# Altium schematic sheet MPP_M2_extension.SchDoc: FPGA Peripherals Board - M.2 Key E
size A3; Author: mayerph; DrawnBy: mayerph; Organization: IIS; Revision: PA; SheetNumber: 3; SheetTotal: 7
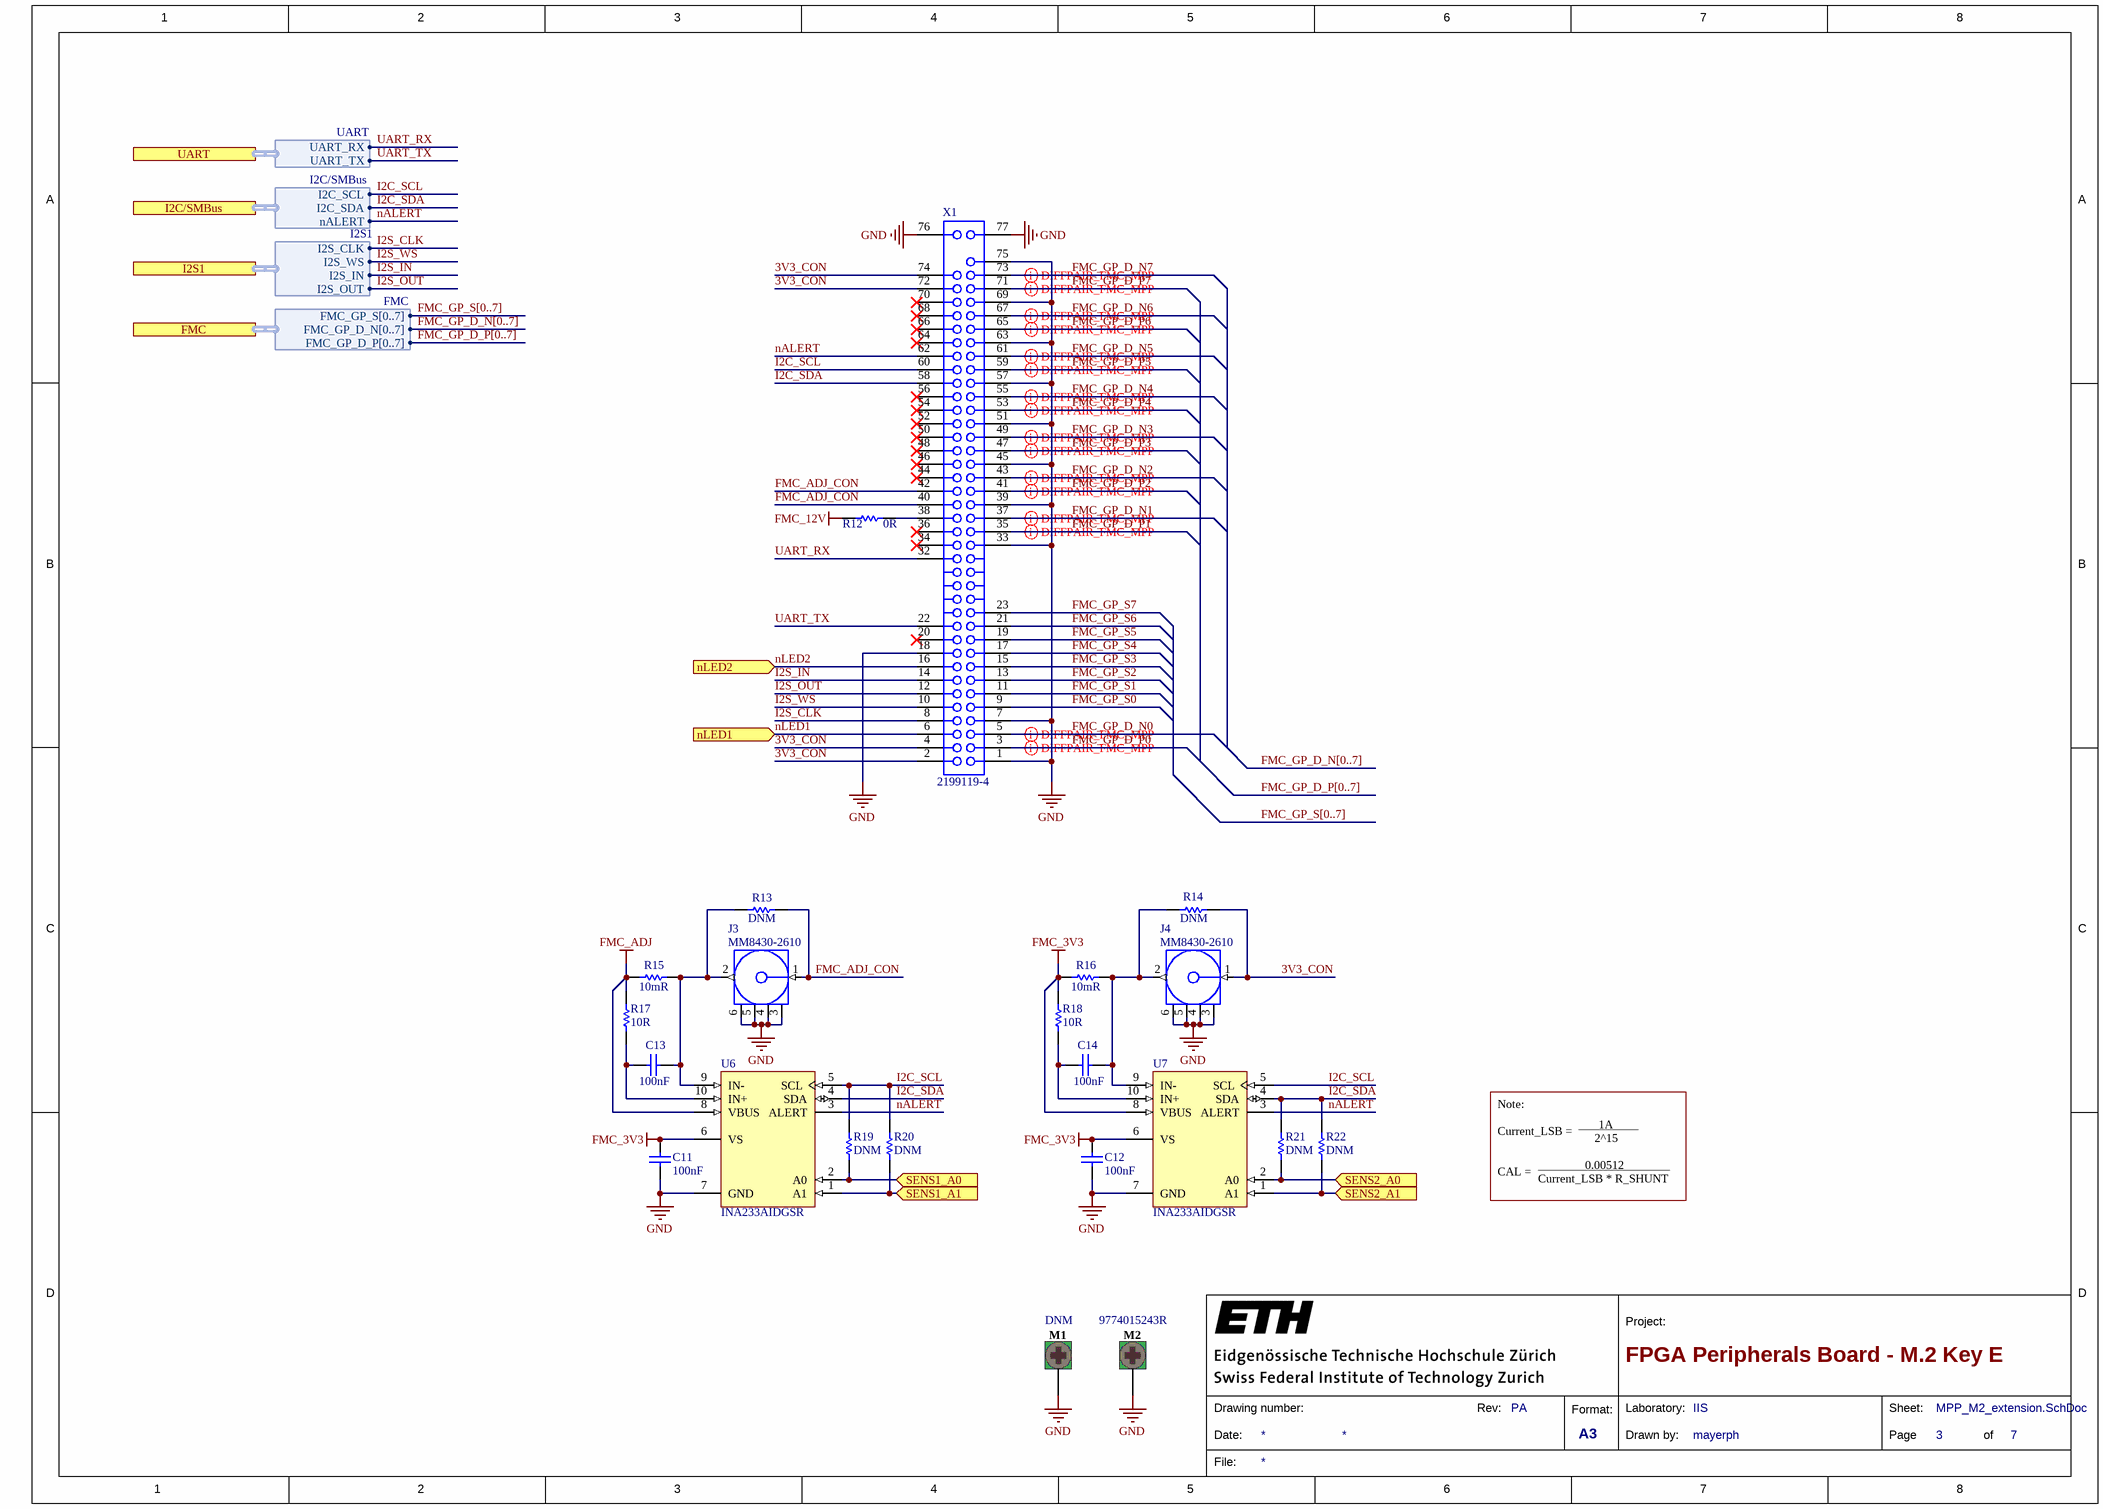
[diagram p0: MPP_M2_extension.SchDoc]

## Parts
C11  100nF  [CAPC1050X55X23LL05T13]
C12  100nF  [CAPC1050X55X23LL05T13]
C13  100nF  [CAPC1050X55X23LL05T13]
C14  100nF  [CAPC1050X55X23LL05T13]
J3  MM8430-2610  [MM8430-2610]
J4  MM8430-2610  [MM8430-2610]
M1  DNM  [9774015243R]
M2  9774015243R  [9774015243R]
R12  0R  [RESC1005X40X25LL05T10]
R13  DNM  [RESC1005X40X25LL05T10]
R14  DNM  [RESC1005X40X25LL05T10]
R15  10mR  [RESC3116X65X40NL10T20]
R16  10mR  [RESC3116X65X40NL10T20]
R17  10R  [RESC1005X40X25LL10T10]
R18  10R  [RESC1005X40X25LL10T10]
R19  DNM  [RESC1005X40X25LL05T10]
R20  DNM  [RESC1005X40X25LL05T10]
R21  DNM  [RESC1005X40X25LL05T10]
R22  DNM  [RESC1005X40X25LL05T10]
U6  INA233AIDGSR  [ADI-RM-10_N]
U7  INA233AIDGSR  [ADI-RM-10_N]
X1  2199119-4  [2199119-4]

## Ports
FMC (harness FMC), I2C/SMBus (harness I2C/SMBus), I2S1 (harness I2S1), nLED1 (in), nLED2 (in), SENS1_A0 (in), SENS1_A1 (in), SENS2_A0 (in), SENS2_A1 (in), UART (harness UART)

## Harnesses
I2C/SMBus: I2C_SDA, I2C_SCL, nALERT
UART: UART_TX, UART_RX
I2S1: I2S_OUT, I2S_IN, I2S_WS, I2S_CLK
FMC: FMC_GP_D_N[0..7], FMC_GP_S[0..7], FMC_GP_D_P[0..7]

## Nets
FMC_3V3: C11.2 C12.2 R16.1 R18.2 U6.6(VS) U7.6(VS) U7.8(VBUS)
FMC_12V: R12.2
FMC_ADJ: R15.1 R17.2 U6.8(VBUS)
GND: C11.1 C12.1 J3.3(GND) J3.4(GND) J3.5(GND) J3.6(GND) J4.3(GND) J4.4(GND) J4.5(GND) J4.6(GND) M1.1 M2.1 U6.7(GND) U7.7(GND) X1.1 X1.7 X1.18 X1.33 X1.39 X1.45 X1.51 X1.57 X1.63 X1.69 X1.75 X1.76 X1.77
3V3_CON: J4.1(Signal) R14.1 X1.2 X1.4 X1.72 X1.74
FMC_ADJ_CON: J3.1(Signal) R13.1 X1.40 X1.42
FMC_GP_D_N0: X1.5
FMC_GP_D_N1: X1.37
FMC_GP_D_N2: X1.43
FMC_GP_D_N3: X1.49
FMC_GP_D_N4: X1.55
FMC_GP_D_N5: X1.61
FMC_GP_D_N6: X1.67
FMC_GP_D_N7: X1.73
FMC_GP_D_P0: X1.3
FMC_GP_D_P1: X1.35
FMC_GP_D_P2: X1.41
FMC_GP_D_P3: X1.47
FMC_GP_D_P4: X1.53
FMC_GP_D_P5: X1.59
FMC_GP_D_P6: X1.65
FMC_GP_D_P7: X1.71
FMC_GP_S0: X1.9
FMC_GP_S1: X1.11
FMC_GP_S2: X1.13
FMC_GP_S3: X1.15
FMC_GP_S4: X1.17
FMC_GP_S5: X1.19
FMC_GP_S6: X1.21
FMC_GP_S7: X1.23
I2C_SCL: R19.1 R20.1 U6.5(SCL) U7.5(SCL) X1.60 ; port I2C/SMBus.I2C_SCL
I2C_SDA: R21.1 R22.1 U6.4(SDA) U7.4(SDA) X1.58 ; port I2C/SMBus.I2C_SDA
I2S_CLK: X1.8 ; port I2S1.I2S_CLK
I2S_IN: X1.14 ; port I2S1.I2S_IN
I2S_OUT: X1.12 ; port I2S1.I2S_OUT
I2S_WS: X1.10 ; port I2S1.I2S_WS
nALERT: U6.3(ALERT) U7.3(ALERT) X1.62 ; port I2C/SMBus.nALERT
nLED1: X1.6 ; port nLED1
nLED2: X1.16 ; port nLED2
SENS1_A0: R19.2 U6.2(A0) ; port SENS1_A0
SENS1_A1: R20.2 U6.1(A1) ; port SENS1_A1
SENS2_A0: R21.2 U7.2(A0) ; port SENS2_A0
SENS2_A1: R22.2 U7.1(A1) ; port SENS2_A1
UART_RX: X1.32 ; port UART.UART_RX
UART_TX: X1.22 ; port UART.UART_TX
NetC13_1: C13.1 J3.2(Signal) R13.2 R15.2 U6.9(IN-)
NetC13_2: C13.2 R17.1 U6.10(IN+)
NetC14_1: C14.1 J4.2(Signal) R14.2 R16.2 U7.9(IN-)
NetC14_2: C14.2 R18.1 U7.10(IN+)
NetR12_1: R12.1 X1.38

Not connected (* = marked no-connect by the designer): X1 20* 34* 36* 44* 46* 48* 50* 52(51)* 54(52)* 56(53)* 64* 66* 68* 70*

## Buses and harness runs
bus FMC_GP_D_N[0..7]
bus FMC_GP_D_P[0..7]
bus FMC_GP_S[0..7]

## Layout directives
differential pair; net class DP_FMC_MPP_CON1: FMC_GP_D_N0, FMC_GP_D_N1, FMC_GP_D_N2, FMC_GP_D_N3, FMC_GP_D_N4, FMC_GP_D_N5, FMC_GP_D_N6, FMC_GP_D_N7, FMC_GP_D_P0, FMC_GP_D_P1, FMC_GP_D_P2, FMC_GP_D_P3, FMC_GP_D_P4, FMC_GP_D_P5, FMC_GP_D_P6, FMC_GP_D_P7

## Notes on the sheet
- Note:
- __________
- 1A
- CAL =
- Current_LSB =
- Current_LSB * R_SHUNT
- ______________________
- 0.00512
- 2^15
- 1
- 2
- 3
- 4
- 5
- 6
- 7
- 8
- A
- B
- C
- D
- Project:
- Date:
- Drawing number:
- Rev:
- Format:
- A3
- Drawn by:
- Laboratory:
- Page
- Sheet:
- of
- File:

## Library data of the parts
C11-C14 = CMP-2000-05439-1: Chip Capacitor, 100 nF, +/- 10%, 16 V, -55 to 125 degC, 0402 (1005 Metric), RoHS, Tape and Reel; Manufacturer: Samsung Electro-Mechanics; Manufacturer Part Number: CL05B104KO5NNNC; Dielectric: X7R; Rated Voltage: 16V; Material: Ceramic; Case Size/Dimension: 0402; Tolerance (%): ±10%; Value: 100nF; Manufacturer URL: http://www.samsungsem.com/global/index.jsp; Datasheet URL: https://datasheet.ciiva.com/29198/458718-da-01-en-vs-kondensator-0402-29198423.pdf; Datasheet Version: Nov-10; Supplier 1: Digi-Key; Supplier Part Number 1: 1276-1001-1-ND; RoHS: Yes; Category: Ceramic Capacitors; Stock 1: 18886859; Pricing 1: 1=0.10000, 10=0.02800, 50=0.01520, 100=0.01240, 500=0.00886, 1000=0.00696, 2500=0.00632, 5000=0.00582 (USD); Mount: Surface Mount; Case/Package: 0402; Case Code (Metric): 1005; Case Code (Imperial): 0402; Contact Plating: Tin; Min Operating Temperature: -55°C; Max Operating Temperature: 125°C; Tolerance: 10%; Packaging: Tape and Reel; Voltage Rating: 16V; Voltage Rating (DC): 16V; Package Quantity: 1; Voltage: 16V; Length: 1mm; Height: 0.5mm; Width: 0.02inch; Depth: 0.5mm; Thickness: 0.022inch; Radiation Hardening: No; Lead Free: Lead Free; ComponentLink1URL: https://datasheet.ciiva.com/26920/getdatasheetpartid-359683-26920169.pdf?src-supplier=Verical; ComponentLink1Description: https://datasheet.ciiva.com/26920/getdatasheetpartid-359683-26920169.pdf?src-supplier=Verical; ComponentLink2URL: https://datasheet.ciiva.com/29198/458718-da-01-en-vs-kondensator-0402-29198423.pdf?src-supplier=Conrad; ComponentLink2Description: https://datasheet.ciiva.com/29198/458718-da-01-en-vs-kondensator-0402-29198423.pdf?src-supplier=Conrad; ComponentLink3URL: https://datasheet.ciiva.com/16208/cl05b104kq5nnnc-16208343.pdf?src-supplier=Future+Electronics; ComponentLink3Description: https://datasheet.ciiva.com/16208/cl05b104kq5nnnc-16208343.pdf?src-supplier=Future+Electronics; ComponentLink4URL: https://datasheet.ciiva.com/26309/mlcc-catalogdownload2013-eng-26309003.pdf?src-supplier=Distrelec; ComponentLink4Description: https://datasheet.ciiva.com/26309/mlcc-catalogdownload2013-eng-26309003.pdf?src-supplier=Distrelec
J3 J4 = CMP-01324-2: SWD Connector Receptacle, Female Socket 50Ohm Surface Mount Solder; Manufacturer: Murata; Manufacturer Part Number: MM8430-2610RA1; Impedance: 50R; Max Frequency: 6GHz; Polarity: Standard; Description: CONN SWD RCPT STR 50 OHM SMD; Fastening Type: Pull; Max Operating Temperature: 85°C; Lead Free: Lead Free; Radiation Hardening: No; Package Quantity: 1; Series: 8430; Connector Type: Socket; Mount: Surface Mount; Contact Material: Copper Alloy; Housing Color: Silver; Case/Package: SMD/SMT; Orientation: Straight; Depth: 3mm; Packaging: Tape and Reel; Insulation Material: Plastic; Length: 3mm; Contact Plating: Gold; Min Operating Temperature: -40°C; Termination: Solder; Supplier 1: Digi-Key; Supplier Part Number 1: 490-4980-1-ND; RoHS: Yes; Category: RF / Coaxial Connectors; Stock 1: 398; Pricing 1: 1=0.49000, 10=0.45800, 25=0.41200, 50=0.36620, 100=0.35100, 250=0.32048, 500=0.30520 (USD); ComponentLink1URL: https://datasheet.ciiva.com/18119/getdatasheetpartid-163587-18119363.pdf?src-supplier=Verical; ComponentLink1Description: https://datasheet.ciiva.com/18119/getdatasheetpartid-163587-18119363.pdf?src-supplier=Verical; ComponentLink2URL: https://datasheet.ciiva.com/18119/getdatasheetpartid-153066-18119191.pdf?src-supplier=Verical; ComponentLink2Description: https://datasheet.ciiva.com/18119/getdatasheetpartid-153066-18119191.pdf?src-supplier=Verical; ComponentLink3URL: https://datasheet.ciiva.com/642/o33e-642736.pdf?src-supplier=Digi-Key; ComponentLink3Description: https://datasheet.ciiva.com/642/o33e-642736.pdf?src-supplier=Digi-Key; ComponentLink4URL: https://datasheet.ciiva.com/16465/l0391e-16465770.pdf?src-supplier=Future+Electronics; ComponentLink4Description: https://datasheet.ciiva.com/16465/l0391e-16465770.pdf?src-supplier=Future+Electronics; ComponentLink5URL: https://datasheet.ciiva.com/642/o33e-642735.pdf?src-supplier=Digi-Key; ComponentLink5Description: https://datasheet.ciiva.com/642/o33e-642735.pdf?src-supplier=Digi-Key
M1 M2 = CMP-01222-1: RND STANDOFF M2X0.4 STEEL 1.5MM; Manufacturer: Wurth Electronics; Plating: Tin; Outside Diameter: 0.171inch; Threaded/Unthreaded: Threaded; Length: 0.114inch; REACH SVHC: Unknown; Material: Steel; Supplier 1: Digi-Key; Supplier Part Number 1: 732-7069-1-ND; Manufacturer Part Number: 9774015243R; RoHS: Yes; Category: Spacers, Standoffs; Stock 1: 6453; Pricing 1: 1=1.09000, 10=1.03000, 50=0.91800, 100=0.84000, 500=0.78400 (USD); ComponentLink1URL: http://www.mouser.com/ds/2/445/9774015243R-611439.pdf?src-supplier=Mouser; ComponentLink1Description: http://www.mouser.com/ds/2/445/9774015243R-611439.pdf?src-supplier=Mouser; ComponentLink2URL: http://www.farnell.com/datasheets/1960361.pdf?src-supplier=Farnell; ComponentLink2Description: http://www.farnell.com/datasheets/1960361.pdf?src-supplier=Farnell; ComponentLink3URL: https://media.digikey.com/pdf/Data%20Sheets/Wurth%20Electronics%20PDFs/WA-SMSx_Performance_Flyer.pdf?src-supplier=Digi-Key; ComponentLink3Description: https://media.digikey.com/pdf/Data%20Sheets/Wurth%20Electronics%20PDFs/WA-SMSx_Performance_Flyer.pdf?src-supplier=Digi-Key; ComponentLink4URL: http://www.farnell.com/datasheets/1960361.pdf?src-supplier=Element14; ComponentLink4Description: http://www.farnell.com/datasheets/1960361.pdf?src-supplier=Element14; ComponentLink5URL: https://katalog.we-online.de/em/datasheet/9774015243R.pdf?src-supplier=Digi-Key; ComponentLink5Description: https://katalog.we-online.de/em/datasheet/9774015243R.pdf?src-supplier=Digi-Key; ComponentLink6URL: http://www.farnell.com/datasheets/1960361.pdf?src-supplier=Newark; ComponentLink6Description: http://www.farnell.com/datasheets/1960361.pdf?src-supplier=Newark
R12-R14 R19-R22 = CMP-2002-07912-1: Manufacturer: Yageo; Part Number: RC0402JR-070RL; Value: 0 Ohm; Power Rating: 62.5mW; Tolerance: 5%; Voltage Rating: 50V; Temperature Coefficient: 200ppm/°C; Max Power Dissipation: 63mW; Supplier 1: Digi-Key; Supplier Part Number 1: 311-0.0JRCT-ND; Manufacturer Part Number: RC0402JR-070RL; RoHS: Yes; Category: Chip SMD Resistors; Stock 1: 44193294; Pricing 1: 1=0.10000, 10=0.01200, 25=0.00840, 50=0.00640, 100=0.00480, 250=0.00364, 500=0.00292, 1000=0.00215, 5000=0.00154 (USD); Case/Package: 0402; Contact Plating: Tin,Matte; Case Code (Metric): 1005; Case Code (Imperial): 0402; Min Operating Temperature: -55°C; Max Operating Temperature: 155°C; Resistor Type: Thick Film; Packaging: Tape and Reel; Termination: SMD/SMT; Package Quantity: 1; Number of Terminations: 2; Features: Moisture Resistant; Length: 1mm; Height: 0.016inch; Width: 0.02inch; Depth: 0.5mm; Radiation Hardening: No; Lead Free: Lead Free; REACH SVHC: Unknown; Military Standard: Not; ComponentLink1URL: https://datasheet.ciiva.com/2452/pyu-rc0402-51-rohs-l-6-2452608.pdf?src-supplier=Digi-Key; ComponentLink1Description: https://datasheet.ciiva.com/2452/pyu-rc0402-51-rohs-l-6-2452608.pdf?src-supplier=Digi-Key; ComponentLink2URL: https://datasheet.ciiva.com/11808/0900766b80c66297-11808195.pdf?src-supplier=RSComponents; ComponentLink2Description: https://datasheet.ciiva.com/11808/0900766b80c66297-11808195.pdf?src-supplier=RSComponents; ComponentLink3URL: https://datasheet.ciiva.com/2452/pyu-r-int-thick-7-2452609.pdf?src-supplier=Digi-Key; ComponentLink3Description: https://datasheet.ciiva.com/2452/pyu-r-int-thick-7-2452609.pdf?src-supplier=Digi-Key; ComponentLink4URL: https://datasheet.ciiva.com/2452/pyu-r-int-thick-7-2452610.pdf?src-supplier=Digi-Key; ComponentLink4Description: https://datasheet.ciiva.com/2452/pyu-r-int-thick-7-2452610.pdf?src-supplier=Digi-Key; ComponentLink5URL: https://datasheet.ciiva.com/8896/pyu-rc0402-51-rohs-l-6-8896201.pdf?src-supplier=Avnet; ComponentLink5Description: https://datasheet.ciiva.com/8896/pyu-rc0402-51-rohs-l-6-8896201.pdf?src-supplier=Avnet; ComponentLink6URL: https://datasheet.ciiva.com/28386/pyu-rc0402-51-rohs-l-6-28386633.pdf?src-supplier=Avnet+Europe; ComponentLink6Description: https://datasheet.ciiva.com/28386/pyu-rc0402-51-rohs-l-6-28386633.pdf?src-supplier=Avnet+Europe; ComponentLink7URL: https://datasheet.ciiva.com/22747/1018594-22747515.pdf?src-supplier=Element14; ComponentLink7Description: https://datasheet.ciiva.com/22747/1018594-22747515.pdf?src-supplier=Element14; ComponentLink8URL: https://datasheet.ciiva.com/15189/getdatasheetpartid-326379-15189533.pdf?src-supplier=Verical; ComponentLink8Description: https://datasheet.ciiva.com/15189/getdatasheetpartid-326379-15189533.pdf?src-supplier=Verical; ComponentLink9URL: https://datasheet.ciiva.com/7983/1018594-7983535.pdf?src-supplier=Element14; ComponentLink9Description: https://datasheet.ciiva.com/7983/1018594-7983535.pdf?src-supplier=Element14
R15 R16 = CMP-2003-04059-1: Part Number: RL1206FR-070R01L; Manufacturer: Yageo; Tolerance: 1%; Value: 10 mOhm; Temperature Coefficient: 1500ppm/°C; Power Rating: 250mW; Supplier 1: Digi-Key; Supplier Part Number 1: 311-0.01LWCT-ND; Manufacturer Part Number: RL1206FR-070R01L; RoHS: Yes; Category: Chip SMD Resistors; Stock 1: 76097; Pricing 1: 1=0.61000, 10=0.47000, 100=0.19750, 1000=0.10896, 2500=0.10215 (USD); Case/Package: 1206; Case Code (Metric): 3216; Case Code (Imperial): 1206; Contact Plating: Tin,Lead; Size Code: 1206; Min Operating Temperature: -55°C; Max Operating Temperature: 125°C; Packaging: Tape and Reel; Package Quantity: 1; Termination: SMD/SMT; Features: Moisture Resistant; Series: RL; Resistor Type: Thick Film; Number of Terminations: 2; Max Power Dissipation: 250mW; Construction: Rectangular; Technology: THICK FILM; Length: 3.1mm; Width: 0.063inch; Height: 0.026inch; Depth: 1.6mm; Radiation Hardening: No; RoHS Compliant: Yes; Lead Free: Lead Free; Military Standard: Not; ComponentLink1URL: https://datasheet.ciiva.com/5557/pyu-rl-hp-521-rohs-l-2-5557947.pdf?src-supplier=Mouser; ComponentLink1Description: https://datasheet.ciiva.com/5557/pyu-rl-hp-521-rohs-l-2-5557947.pdf?src-supplier=Mouser
R17 R18 = CMP-2002-04714-1: Manufacturer: Bourns; Part Number: CR0402-FX-10R0GLF; Tolerance: 1%; Value: 10 Ohm; Temperature Coefficient: 100ppm/°C; Max Power Dissipation: 63mW; Power Rating: 62.5mW; Voltage Rating: 50V; Supplier 1: Digi-Key; Supplier Part Number 1: CR0402-FX-10R0GLFCT-ND; Manufacturer Part Number: CR0402-FX-10R0GLF; RoHS: Yes; Category: Chip SMD Resistors; Stock 1: 21562; Pricing 1: 1=0.10000, 10=0.01000, 100=0.00400, 1000=0.00178, 2500=0.00154, 5000=0.00127 (USD); Mount: Surface Mount; Case/Package: 0402; Case Code (Imperial): 0402; Case Code (Metric): 1005; Contact Plating: Tin; Min Operating Temperature: -55°C; Max Operating Temperature: 125°C; Packaging: Tape and Reel; Resistor Type: Thick Film; Number of Terminations: 2; Series: CR0402; Termination: SMD/SMT; Package Quantity: 1; Construction: Rectangular; Length: 1mm; Width: 0.5mm; Height: 0.016inch; Depth: 0.5mm; Thickness: 356um; Radiation Hardening: No; RoHS Compliant: Yes; Military Standard: Not; ComponentLink1URL: https://datasheet.ciiva.com/6562/cr0402-6562982.pdf?src-supplier=Digi-Key; ComponentLink1Description: https://datasheet.ciiva.com/6562/cr0402-6562982.pdf?src-supplier=Digi-Key; ComponentLink2URL: https://datasheet.ciiva.com/6562/cr0402-6562983.pdf?src-supplier=Digi-Key; ComponentLink2Description: https://datasheet.ciiva.com/6562/cr0402-6562983.pdf?src-supplier=Digi-Key; ComponentLink3URL: https://datasheet.ciiva.com/16938/cr0402-16938199.pdf?src-supplier=Avnet+Europe; ComponentLink3Description: https://datasheet.ciiva.com/16938/cr0402-16938199.pdf?src-supplier=Avnet+Europe; ComponentLink4URL: https://datasheet.ciiva.com/30075/cr0402-30075881.pdf?src-supplier=Onlinecomponents.com; ComponentLink4Description: https://datasheet.ciiva.com/30075/cr0402-30075881.pdf?src-supplier=Onlinecomponents.com; ComponentLink5URL: https://datasheet.ciiva.com/9122/cr0402-9122317.pdf?src-supplier=Avnet; ComponentLink5Description: https://datasheet.ciiva.com/9122/cr0402-9122317.pdf?src-supplier=Avnet
U6 U7 = CMP-01322-1: Current Monitor Regulator High/Low-Side 10mA 10-VSSOP; Manufacturer: Texas Instruments; Accuracy: 0.1%; Packaging: Tape and Reel; Output Current: 10mA; Max Operating Temperature: 125°C; RoHS Compliant: Yes; Case/Package: VSSOP; Min Operating Temperature: -40°C; Mount: Surface Mount; Supplier 1: Mouser; Supplier Part Number 1: 595-INA233AIDGSR; Manufacturer Part Number: INA233AIDGSR; RoHS: Yes; Category: Amplifiers - Op Amps, Buffer, Instrumentation; Stock 1: 2070; Pricing 1: 1=3.31000, 10=2.98000, 50=2.82000, 100=2.32000, 1000=1.67000, 10000=1.60000 (USD); ComponentLink1URL: http://www.ti.com/lit/ds/symlink/ina233.pdf?src-supplier=Digi-Key; ComponentLink1Description: http://www.ti.com/lit/ds/symlink/ina233.pdf?src-supplier=Digi-Key
X1 = CMP-01221-1: 67 Position Female Connector M.2 (NGFF) Mini Card Gold 0.020" (0.50mm) Black; Manufacturer: TE Connectivity; Manufacturer Part Number: 2199230-4; PCB Mounting Orientation: Right Angle; Contact Current Rating: 500mA; Pitch: 0.5mm; Row Spacing: 7.55mm; Voltage Rating: 50V; Insulation Resistance: 500MR; Number of Positions: 67; Gender: Female; Termination: Solder; Max Operating Temperature: 80°C; REACH SVHC: Unknown; Width: 8.7mm; ELV: Compliant; Package Quantity: 1; Current Rating: 500mA; Packaging: Tape and Reel; Height: 3.2mm; Length: 0.862inch; Mount: Surface Mount; Insulation Material: Thermoplastic; Contact Plating: Gold,Matte; Housing Material: Thermoplastic; Min Operating Temperature: -40°C; Housing Color: Black; Number of Contacts: 67; Orientation: Right Angle; Contact Material: Copper Alloy; Color: Black; Number of Rows: 2; Supplier 1: Digi-Key; Supplier Part Number 1: A115904CT-ND; RoHS: Yes; Category: Card Edge Connectors; Stock 1: 14351; Pricing 1: 1=1.29000, 10=1.13700, 25=1.07000, 50=1.02560, 100=0.98100, 250=0.89180, 500=0.80262 (USD); RoHS Compliant: Yes; ComponentLink1URL: https://datasheet.ciiva.com/28797/1918022-28797830.pdf?src-supplier=Element14; ComponentLink1Description: https://datasheet.ciiva.com/28797/1918022-28797830.pdf?src-supplier=Element14; ComponentLink2URL: https://datasheet.ciiva.com/18495/eng-cd-2199230-b1-c-2199230-b1-18495978.pdf?src-supplier=Digi-Key; ComponentLink2Description: https://datasheet.ciiva.com/18495/eng-cd-2199230-b1-c-2199230-b1-18495978.pdf?src-supplier=Digi-Key; ComponentLink3URL: https://datasheet.ciiva.com/18495/eng-cd-2199230-b1-c-2199230-b1-18495979.pdf?src-supplier=Digi-Key; ComponentLink3Description: https://datasheet.ciiva.com/18495/eng-cd-2199230-b1-c-2199230-b1-18495979.pdf?src-supplier=Digi-Key; ComponentLink4URL: https://datasheet.ciiva.com/18495/eng-cd-2199230-b1-c-2199230-b1-18495980.pdf?src-supplier=Digi-Key; ComponentLink4Description: https://datasheet.ciiva.com/18495/eng-cd-2199230-b1-c-2199230-b1-18495980.pdf?src-supplier=Digi-Key; ComponentLink5URL: https://datasheet.ciiva.com/22714/1918022-22714780.pdf?src-supplier=Element14; ComponentLink5Description: https://datasheet.ciiva.com/22714/1918022-22714780.pdf?src-supplier=Element14; ComponentLink6URL: https://datasheet.ciiva.com/28797/1918022-28797822.pdf?src-supplier=Element14; ComponentLink6Description: https://datasheet.ciiva.com/28797/1918022-28797822.pdf?src-supplier=Element14